# EasyEDA Pro project 小张FOC-STM32G431CBU6.epro, schematic Schematic3
Board Name: 调试拓展板; Create Date: 2024-11-03; Page Name: P1; Project Name: 小张FOC-STM32G431CBU6; Schematic Name: Schematic3; Update Date: 2024-11-03; Company: 嘉立创EDA; Page Size: A4; Version: V1.0
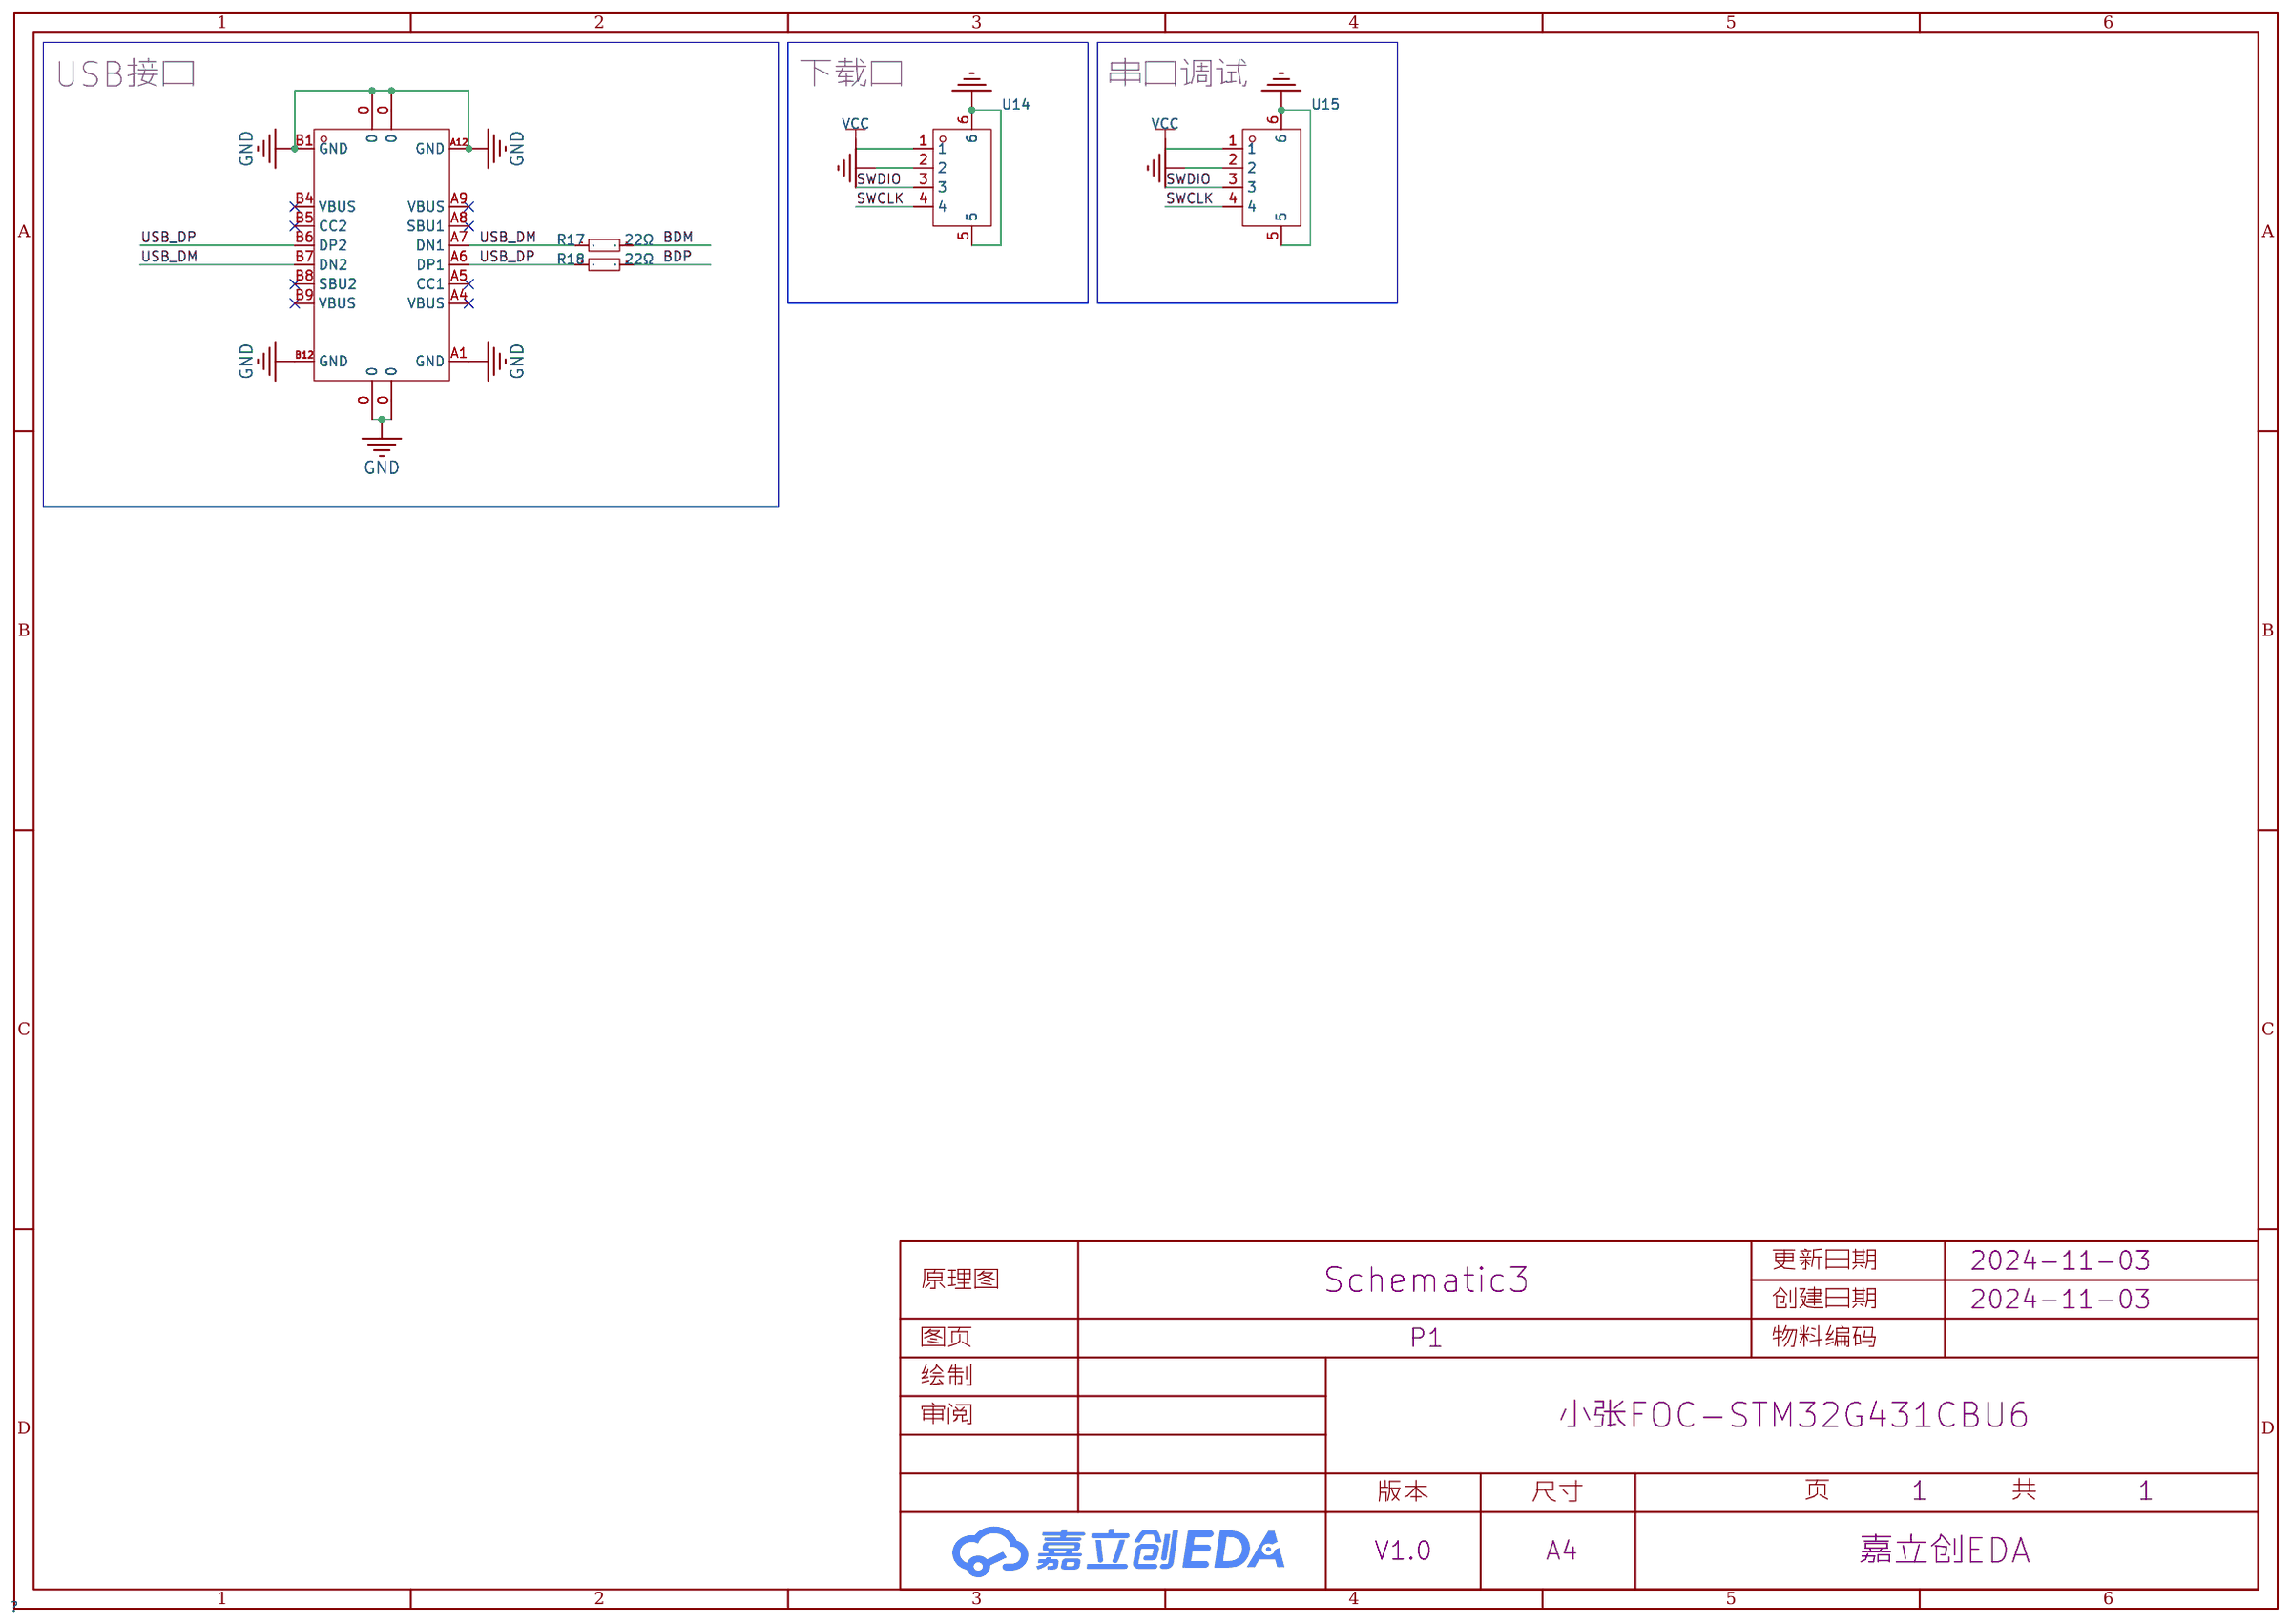
[diagram p3: schematic sheet]

## Parts
R17  22Ω  [R0603_S]
R18  22Ω  [R0603_S]
U14  WAFER-GH1.25-4PWB  [CONN-SMD_4P-P1.25_XUNPU_WAFER-GH1.25-4PWB]
U15  WAFER-GH1.25-4PWB  [CONN-SMD_4P-P1.25_XUNPU_WAFER-GH1.25-4PWB]
USBC1  -  [USB-C_SMD-TYPE-C-31-M-12]

## Library data of the parts
R17 R18 = 0603WAF220JT5E: 电阻类型:厚膜电阻;阻值:22Ω;精度:±1%;功率:100mW;最大工作电压:75V;温度系数:±100ppm/℃;; LCSC Part Name: 22Ω ±1% 100mW 厚膜电阻; Supplier Part: C23345; Manufacturer: UNI-ROYAL(厚声); Supplier Footprint: 0603; JLCPCB Part Class: 基础库; Datasheet: https://atta.szlcsc.com/upload/public/pdf/source/20200306/C422600_1E6D84923E4A46A82E41ADD87F860B5C.pdf; Supplier: LCSC; Type: 厚膜电阻; Tolerance: ±1%; Power(Watts): 100mW; Overload Voltage (Max): 75V; Temperature Coefficient: ±100ppm/℃; Operating Temperature Range: -55℃~+155℃; Pin Type: IN; Check: true
U14 U15 = WAFER-GH1.25-4PWB: 插针结构:1x4P;间距:1.25mm;安装方式:卧贴;参考系列:GH;总PIN数:4P;排数:1;每排PIN数:4;额定电流:1A;工作温度范围:-25℃~+85℃;; LCSC Part Name: 1x4P 间距:1.25mm 卧贴 系列:GH; Supplier Part: C3029379; Manufacturer: XUNPU(讯普); Supplier Footprint: SMD,P=1.25mm,卧贴; JLCPCB Part Class: 扩展库; Datasheet: https://atta.szlcsc.com/upload/public/pdf/source/20220527/CB8773BFB0913C3B8ABD62CB38BA101A.pdf; Supplier: LCSC; Pins Structure: 1x4P; Pitch: 1.25mm; Mounting Style: 卧贴; Reference Series: GH; Number of Pins: 4P; Number of Rows: 1; Number of PINs Per Row: 4; Current Rating (Max): 1A; Operating Temperature Range: -25℃~+85℃
USBC1 = TYPE-C-31-M-12: 连接器类型:Type-C;标准:-;公母:母座;触点数量:16;端口数量:1;额定电流 - 电源:250mA;; Supplier Part: C165948; Manufacturer: 韩国韩荣; JLCPCB Part Class: ExtendedPart; Datasheet: https://atta.szlcsc.com/upload/public/pdf/source/20210111/C2682493_D8CCFED08835E878D16ACCF4460E43B8.pdf; Supplier: LCSC; Connector Type: Type-C; Gender: 母座; Number of Contacts: 16; Number of Ports: 1; Current Rating - Power (Max): 250mA; Check: true

## Nets
GND: U14.2 U14.5 U14.6 U15.2 U15.5 U15.6 USBC1.0 USBC1.A1(GND) USBC1.A12(GND) USBC1.B1(GND) USBC1.B12(GND)
VCC: U14.1 U15.1
BDM: R17.2
BDP: R18.2
SWCLK: U14.4 U15.4
SWDIO: U14.3 U15.3
USB_DM: R17.1 USBC1.A7(DN1) USBC1.B7(DN2)
USB_DP: R18.1 USBC1.A6(DP1) USBC1.B6(DP2)

Not connected (* = marked no-connect by the designer): USBC1 A4(VBUS)* A5(CC1)* A8(SBU1)* A9(VBUS)* B4(VBUS)* B5(CC2)* B8(SBU2)* B9(VBUS)*

## Notes on the sheet
- USB接口
- 下载口
- 串口调试
